# EAGLE board bms_v02 (EAGLE 6.5.0), part 1 of 2
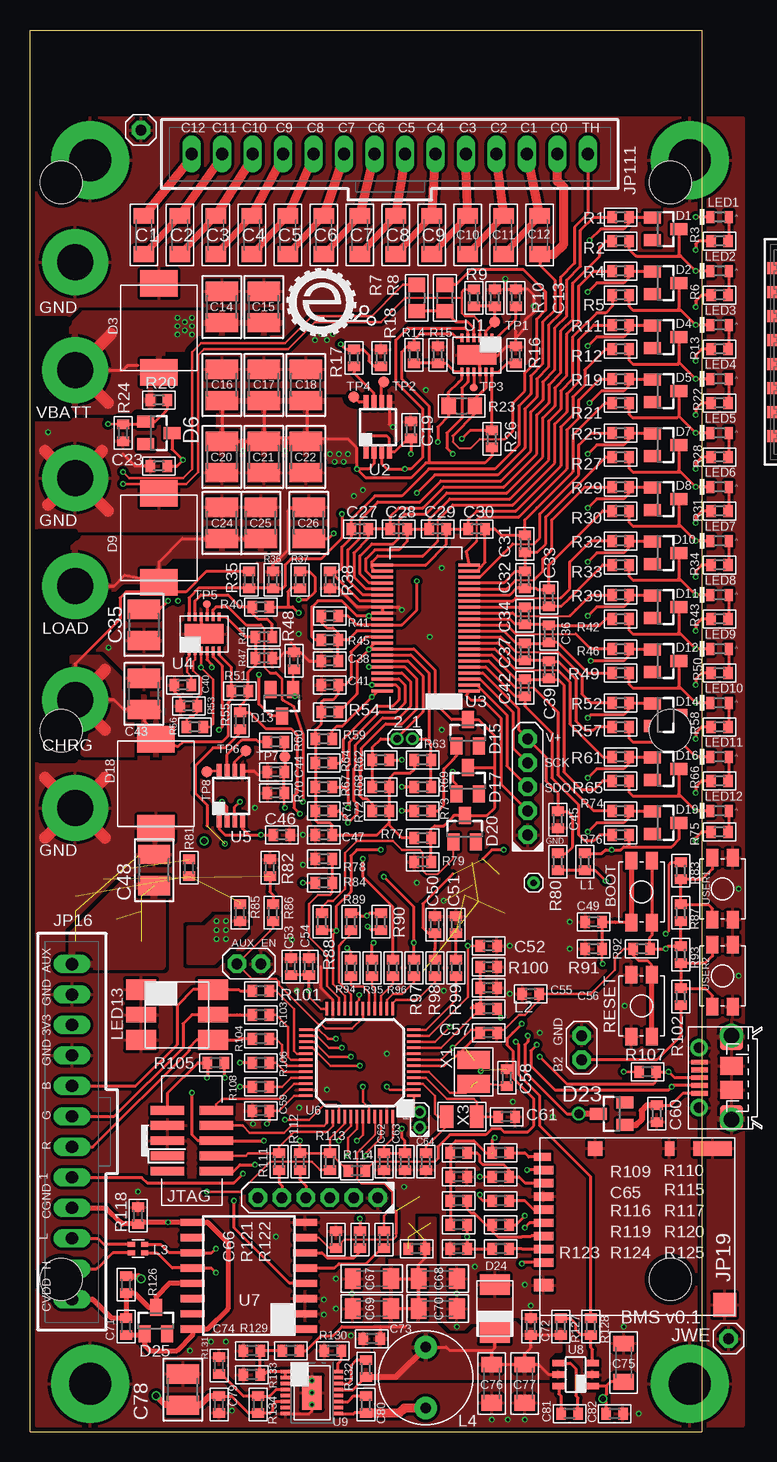
[diagram p3: board, top side]
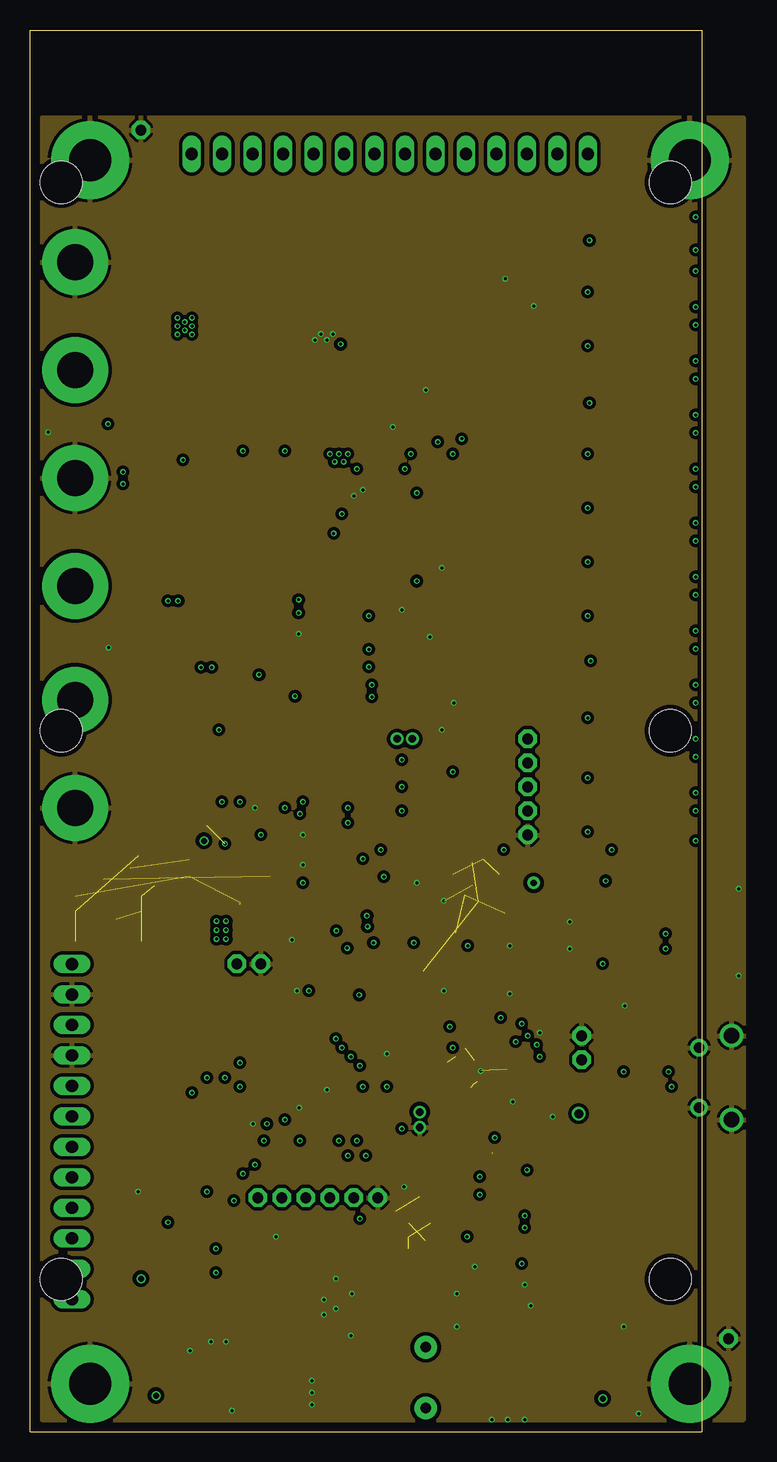
[diagram p4: board, inner layer Route2]
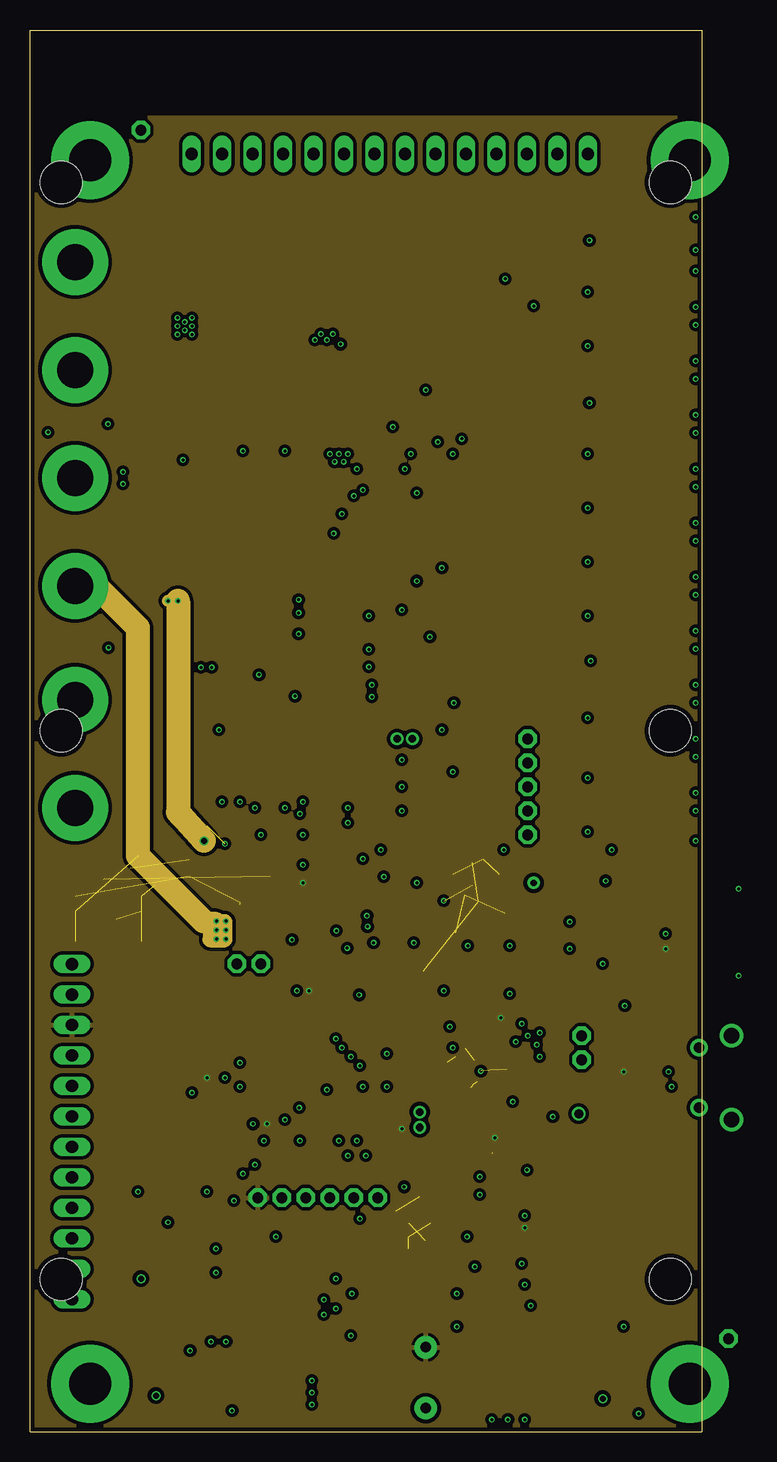
[diagram p5: board, inner layer Route15]
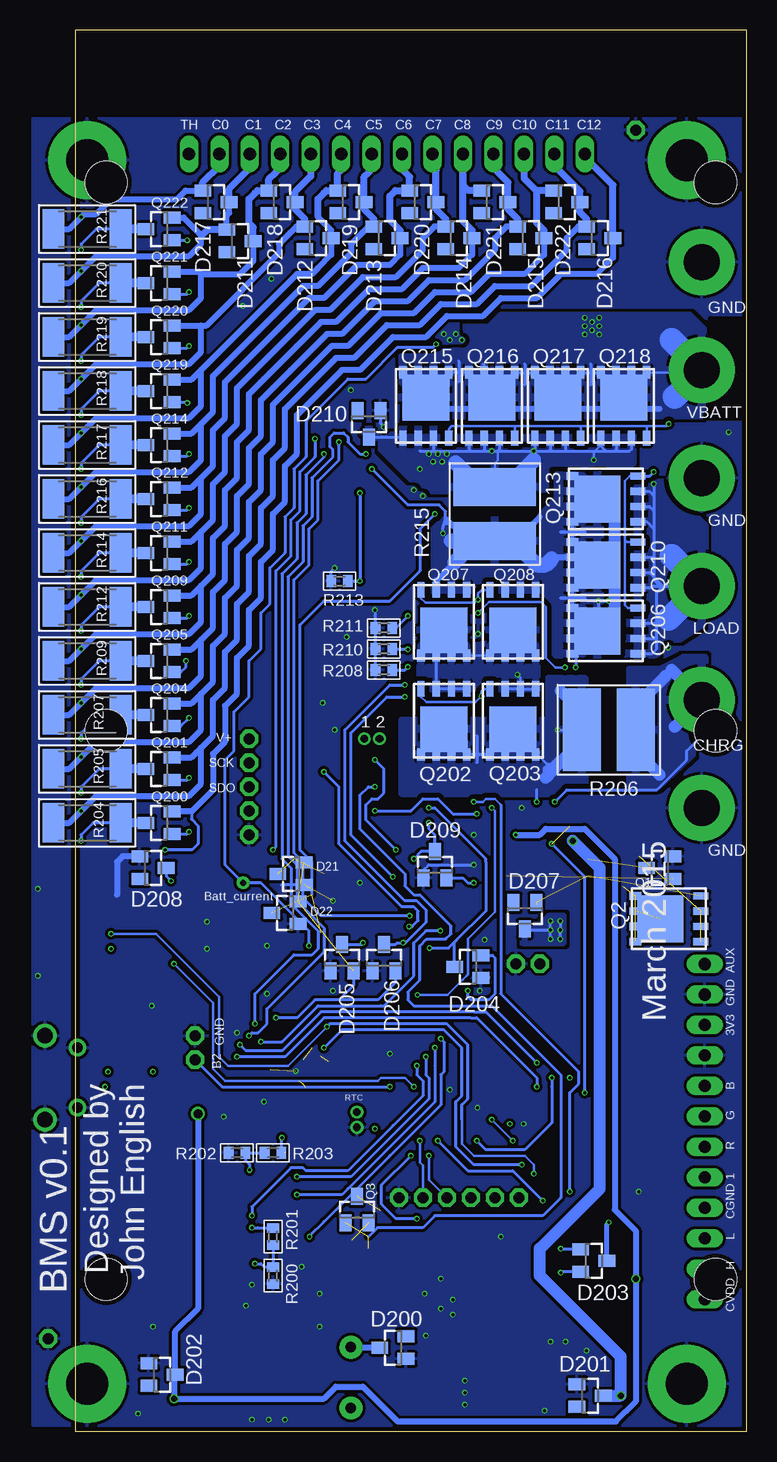
[diagram p6: board, bottom side, seen from below]

Size 56 x 116.84 mm. Coordinates in mm from the lower left corner, seen from the top.
Copper layers (1+2*15+16): Top 0.0356mm / dielectric 12mil / Route2 0.0356mm / dielectric 28mil / Route15 0.0356mm / dielectric 12mil / Bottom 0.0356mm
Design rules "OSH_park_4layer": minimum track width 5mil, minimum drill 10mil, track to track 5mil, track to pad 6mil, pad to pad 6mil, via to via 6mil, smd to smd 6mil, copper to edge 15mil, drill to drill 6mil, minimum pad ring 4mil, minimum via ring 4mil, stop-mask expansion 3mil, vias tented up to drill 20mil, thermal gap 10mil
tRestrict: area 0.8,56 to 3.8,56.2; area 0.8,74.8 to 3.8,75; area 0.2,84.5 to 3.2,84.8; area 0,92.5 to 3,92.8
bRestrict: area 0.2,84.5 to 3.2,84.8; area 0,92.5 to 3,92.8; area -0.5,54.5 to -0.2,57.5

## Footprints (pad centres in the part's own frame; a part is rotated, then mirrored left to right if it is on the bottom)
MOMENTARY_SW_EVQP2 = smd 1.45 x 1: P1 -2.575,-0.85; P2 -2.575,0.85; P3 2.575,-0.85; P4 2.575,0.85
1206_SILK = smd 1.3 x 1.7: P1 -1.6,0; P2 1.6,0
0603_SILK = smd 0.8 x 1: P1 -0.7,0; P2 0.7,0
1210_SILK = smd 1.6 x 2.7: 1 -1.3,0; 2 1.3,0
SOT23 = smd 1 x 1.4: 1 -0.95,-1.1; 2 0.95,-1.1; 3 0,1.1
SMC = smd 3.1 x 2.2: A 0,3.7; C 0,-3.7
SMA = smd 2.5 x 1.7: A 0,-2; C 0,2
HEADER-SMALL-1PIN-0.036IN = drill 0.914 pad 1.524 octagon: P1 0,0
HOLE_3.5MM = drill 3.5 pad 6.5: P$1 0,0
HOLE_3MM = drill 3 pad 5.5: P1 0,0
HEADER-SMALL-2PIN00.05IN = drill 0.635 pad 1.067: P1 -0.635,0; P2 0.635,0
HEADER_2MM_5PIN = drill 0.914 pad 1.524 octagon: P1 -4,0; P2 -2,0; P3 0,0; P4 2,0; P5 4,0
HEADER-SMALL-1PIN-0.02IN = drill 0.508 pad 1.067: P1 0,0
HEADER_2MM_2PIN = drill 0.914 pad 1.524 octagon: P1 -1,0; P2 1,0
USB-MICRO-B-MOLEX_105017 = smd 0.4 x 1.35: P1 -1.3,2.675; P2 -0.65,2.675; P3 0,2.675; P4 0.65,2.675; P5 1.3,2.675 | smd 1.5 x 1.9: PAD1 -1,0; PAD2 1,0 | smd 2 x 1.9: PAD3 -3.3,0; PAD4 3.3,0 | drill 1.3 pad 1.59: PAD3-HOLE -3.5,0; PAD4-HOLE 3.5,0 | drill 0.85 pad 1.45: THRUPAD1 -2.5,2.7; THRUPAD2 2.5,2.7
70543-12 = drill 1.016 long: 1 -13.97,0; 2 -11.43,0; 3 -8.89,0; 4 -6.35,0; 5 -3.81,0; 6 -1.27,0; 7 1.27,0; 8 3.81,0; 9 6.35,0; 10 8.89,0; 11 11.43,0; 12 13.97,0
HEADER_2MM_6PIN = drill 0.914 pad 1.524 octagon: P1 -5,0; P2 -3,0; P3 -1,0; P4 1,0; P5 3,0; P6 5,0
MICROSD_DM3BT = smd 0.7 x 1.6: P1 -4.4,8.175; P2 -3.3,8.175; P3 -2.2,8.175; P4 -1.1,8.175; P5 0,8.175; P6 1.1,8.175; P7 2.2,8.175; P8 3.3,8.175 | smd 0.7 x 1.4: P9 4.4,8.275 | smd 1.2 x 0.8: P10 5.1,-2.325 | smd 1.05 x 1.6: P11 -6.3,8.175 | smd 1.2 x 1.2: P12 5.1,3.875 | smd 1.2 x 3.2: P13 5.1,-5.925 | smd 2 x 1.9: P14 -7.95,-6.925
SCREWTERMINAL_7461057 = drill 1.475 pad 2.2: P1 -2.54,-2.54; P3 2.54,-2.54; P4 2.54,2.54; P5 0,2.54; P6 -2.54,2.54 | drill 1.47 pad 2.2: P2 0,-2.54
SCREWTERMINAL_0760010006 = drill 1.15 pad 2.5: P1 2.54,-3.18; P2 2.54,0; P3 2.54,3.18; P4 -2.54,3.18; P5 -2.54,0; P6 -2.54,-3.18
70543-14 = drill 1.016 long: 1 -16.51,0; 2 -13.97,0; 3 -11.43,0; 4 -8.89,0; 5 -6.35,0; 6 -3.81,0; 7 -1.27,0; 8 1.27,0; 9 3.81,0; 10 6.35,0; 11 8.89,0; 12 11.43,0; 13 13.97,0; 14 16.51,0
JTAG_9PIN_0.05IN_SMD = smd 0.737 x 2.794: P1 -2.54,-2.032; P2 -2.54,2.032; P3 -1.27,-2.032; P4 -1.27,2.032; P5 0,-2.032; P6 0,2.032; P7 1.27,-2.032; P8 1.27,2.032; P9 2.54,-2.032; P10 2.54,2.032
FILTER_EXC24CX = smd 0.4 x 0.6: P1 -0.35,-0.55; P2 0.35,-0.55; P3 0.35,0.55; P4 -0.35,0.55
INDUCTOR_RL895 = drill 0.889 pad 1.905: P1 -2.54,0; P2 2.54,0
LED_0603 = smd 0.65 x 1: 1 -0.775,0; 2 0.775,0
RGB_LED_CLV6A = smd 2.5 x 1.7: 1 -3,2.1; 3 -3,-2.1; 4 3,-2.1; 6 3,2.1 | smd 2.5 x 1.3: 2 -3,0; 5 3,0
POWERPAK_SO-8_SINGLE = smd 1.27 x 0.61: 1S -2.67,1.905; 2S -2.67,0.635; 3S -2.67,-0.635; 4G -2.67,-1.905 | smd 1.016 x 0.635: 5D 2.794,-1.905; 6D 2.794,-0.635; 7D 2.794,0.635; 8D 2.794,1.905 | smd 3.81 x 3.912: 9D 0.7,0
0805_SILK = smd 1.2 x 1.4: P1 -1.1,0; P2 1.1,0
2512_SILK = smd 1.8 x 3.3: 1 -2.8,0; 2 2.8,0
2725_SILK = smd 3.18 x 6.86: P1 -2.25,0; P2 2.25,0
TEST_POINT_0.036IN = smd 0.914 x 0.914: P1 0,0
TEST_POINT_0.025IN = smd 0.635 x 0.635: P1 0,0
DFN12 = smd 0.7 x 0.25: P1 -1.425,1.25; P2 -1.425,0.75; P3 -1.425,0.25; P4 -1.425,-0.25; P5 -1.425,-0.75; P6 -1.425,-1.25; P7 1.425,-1.25; P8 1.425,-0.75; P9 1.425,-0.25; P10 1.425,0.25; P11 1.425,0.75; P12 1.425,1.25 | smd 1.65 x 3.25: TAB 0,0
MSOP-8_LT = smd 1.2 x 0.4: 1 -2.05,0.975; 2 -2.05,0.325; 3 -2.05,-0.325; 4 -2.05,-0.975; 5 2.05,-0.975; 6 2.05,-0.325; 7 2.05,0.325; 8 2.05,0.975
SSOP44 = smd 1.8 x 0.25: 1 -3.625,5.25; 2 -3.625,4.75; 3 -3.625,4.25; 4 -3.625,3.75; 5 -3.625,3.25; 6 -3.625,2.75; 7 -3.625,2.25; 8 -3.625,1.75; 9 -3.625,1.25; 10 -3.625,0.75; 11 -3.625,0.25; 12 -3.625,-0.25; 13 -3.625,-0.75; 14 -3.625,-1.25; 15 -3.625,-1.75; 16 -3.625,-2.25; 17 -3.625,-2.75; 18 -3.625,-3.25; 19 -3.625,-3.75; 20 -3.625,-4.25; 21 -3.625,-4.75; 22 -3.625,-5.25; 23 3.625,-5.25; 24 3.625,-4.75; 25 3.625,-4.25; 26 3.625,-3.75; 27 3.625,-3.25; 28 3.625,-2.75; 29 3.625,-2.25; 30 3.625,-1.75; 31 3.625,-1.25; 32 3.625,-0.75; 33 3.625,-0.25; 34 3.625,0.25; 35 3.625,0.75; 36 3.625,1.25; 37 3.625,1.75; 38 3.625,2.25; 39 3.625,2.75; 40 3.625,3.25; 41 3.625,3.75; 42 3.625,4.25; 43 3.625,4.75; 44 3.625,5.25
TQFP48 = smd 0.2 x 1.1: 1 -2.75,-4.5; 2 -2.25,-4.5; 3 -1.75,-4.5; 4 -1.25,-4.5; 5 -0.75,-4.5; 6 -0.25,-4.5; 7 0.25,-4.5; 8 0.75,-4.5; 9 1.25,-4.5; 10 1.75,-4.5; 11 2.25,-4.5; 12 2.75,-4.5; 25 2.75,4.5; 26 2.25,4.5; 27 1.75,4.5; 28 1.25,4.5; 29 0.75,4.5; 30 0.25,4.5; 31 -0.25,4.5; 32 -0.75,4.5; 33 -1.25,4.5; 34 -1.75,4.5; 35 -2.25,4.5; 36 -2.75,4.5 | smd 1.1 x 0.2: 13 4.5,-2.75; 14 4.5,-2.25; 15 4.5,-1.75; 16 4.5,-1.25; 17 4.5,-0.75; 18 4.5,-0.25; 19 4.5,0.25; 20 4.5,0.75; 21 4.5,1.25; 22 4.5,1.75; 23 4.5,2.25; 24 4.5,2.75; 37 -4.5,2.75; 38 -4.5,2.25; 39 -4.5,1.75; 40 -4.5,1.25; 41 -4.5,0.75; 42 -4.5,0.25; 43 -4.5,-0.25; 44 -4.5,-0.75; 45 -4.5,-1.25; 46 -4.5,-1.75; 47 -4.5,-2.25; 48 -4.5,-2.75
SOIC-16_W_ANALOG = smd 0.6 x 2: P1 -4.445,-4.7; P2 -3.175,-4.7; P3 -1.905,-4.7; P4 -0.635,-4.7; P5 0.635,-4.7; P6 1.905,-4.7; P7 3.175,-4.7; P8 4.445,-4.7; P9 4.445,4.7; P10 3.175,4.7; P11 1.905,4.7; P12 0.635,4.7; P13 -0.635,4.7; P14 -1.905,4.7; P15 -3.175,4.7; P16 -4.445,4.7
SOT23-6 = smd 0.55 x 1.05: 1 -0.95,-1.4; 2 0,-1.4; 3 0.95,-1.4; 4 0.95,1.4; 5 0,1.4; 6 -0.95,1.4
17_MSOP = smd 0.889 x 0.275: 1 -2.17,1.75; 2 -2.17,1.25; 3 -2.17,0.75; 4 -2.17,0.25; 5 -2.17,-0.25; 6 -2.17,-0.75; 7 -2.17,-1.25; 8 -2.17,-1.75; 9 2.17,-1.75; 10 2.17,-1.25; 11 2.17,-0.75; 12 2.17,-0.25; 13 2.17,0.25; 14 2.17,0.75; 15 2.17,1.25; 16 2.17,1.75 | smd 1.651 x 2.845: 17 0,0
QFN-24-NP = smd 0.9 x 0.3: 1 -2.1,1.25; 2 -2.1,0.75; 3 -2.1,0.25; 4 -2.1,-0.25; 5 -2.1,-0.75; 6 -2.1,-1.25; 13 2.1,-1.25; 14 2.1,-0.75; 15 2.1,-0.25; 16 2.1,0.25; 17 2.1,0.75; 18 2.1,1.25 | smd 0.3 x 0.9: 7 -1.25,-2.1; 8 -0.75,-2.1; 9 -0.25,-2.1; 10 0.25,-2.1; 11 0.75,-2.1; 12 1.25,-2.1; 19 1.25,2.1; 20 0.75,2.1; 21 0.25,2.1; 22 -0.25,2.1; 23 -0.75,2.1; 24 -1.25,2.1
POWERBRICK_FULL_VICOR_MAXI = hole 3.5: 25.4,-45.72; 25.4,0; 25.4,45.72; -25.4,45.72; -25.4,0; -25.4,-45.72
NX3225GD = smd 1.5 x 2.7: P1 -1,0; P2 1,0
87832-16 = smd 1 x 2.75: 1 -7,-2.15; 2 -7,2.15; 3 -5,-2.15; 4 -5,2.15; 5 -3,-2.15; 6 -3,2.15; 7 -1,-2.15; 8 -1,2.15; 9 1,-2.15; 10 1,2.15; 11 3,-2.15; 12 3,2.15; 13 5,-2.15; 14 5,2.15; 15 7,-2.15; 16 7,2.15 | hole 1: -6,0; 6,0
ABS07 = smd 1.1 x 1.9: P1 -1.25,0; P2 1.25,0

## Placement (x,y rotation side)
BOOT  [MOMENTARY_SW_EVQP2]  51,45 270 top
C1  10uF  [1206_SILK]  9.5,99.75 270 top
C2  10uF  [1206_SILK]  12.5,99.75 270 top
C3  10uF  [1206_SILK]  15.5,99.75 270 top
C4  10uF  [1206_SILK]  18.5,99.75 270 top
C5  10uF  [1206_SILK]  21.5,99.75 270 top
C6  10uF  [1206_SILK]  24.5,99.75 270 top
C7  10uF  [1206_SILK]  27.5,99.75 270 top
C8  10uF  [1206_SILK]  30.5,99.75 270 top
C9  10uF  [1206_SILK]  33.5,99.75 270 top
C10  10uF  [1206_SILK]  36.5,99.75 270 top
C11  10uF  [1206_SILK]  39.5,99.75 270 top
C12  10uF  [1206_SILK]  42.5,99.75 270 top
C13  1uF  [0603_SILK]  40.5,94.5 90 top
C14  2.2uF  [1210_SILK]  16,93.75 90 top
C15  2.2uF  [1210_SILK]  19.5,93.75 90 top
C16  2.2uF  [1210_SILK]  16,87.25 90 top
C17  2.2uF  [1210_SILK]  19.5,87.25 90 top
C18  2.2uF  [1210_SILK]  23,87.25 90 top
C19  1uF  [0603_SILK]  31.75,83.5 90 top
C20  2.2uF  [1210_SILK]  16,81.25 270 top
C21  2.2uF  [1210_SILK]  19.5,81.25 270 top
C22  2.2uF  [1210_SILK]  23,81.25 270 top
C23  1uF  [0603_SILK]  10.75,80.5 180 top
C24  2.2uF  [1210_SILK]  16,75.75 90 top
C25  2.2uF  [1210_SILK]  19.25,75.75 90 top
C26  2.2uF  [1210_SILK]  23.25,75.75 90 top
C27  0.1uF  [0603_SILK]  27.5,75.25 180 top
C28  0.1uF  [0603_SILK]  30.75,75.25 180 top
C29  0.1uF  [0603_SILK]  34,75.25 180 top
C30  0.1uF  [0603_SILK]  37.25,75.25 180 top
C31  0.1uF  [0603_SILK]  41.25,74 90 top
C32  0.1uF  [0603_SILK]  41.25,71 90 top
C33  0.1uF  [0603_SILK]  43.25,69.5 90 top
C34  0.1uF  [0603_SILK]  41.25,68 90 top
C35  2.2uF  [1210_SILK]  9.5,67.25 270 top
C36  0.1uF  [0603_SILK]  43.25,66.5 90 top
C37  0.1uF  [0603_SILK]  41.25,65 90 top
C38  1uF  [0603_SILK]  25,64.25 180 top
C39  0.1uF  [0603_SILK]  43.25,63.5 90 top
C40  1uF  [0603_SILK]  12.75,62.25 180 top
C41  1uF  [0603_SILK]  25,62.25 180 top
C42  0.1uF  [0603_SILK]  41.25,62 90 top
C43  2.2uF  [1210_SILK]  9.5,61.5 90 top
C44  DNP  [0603_SILK]  20.5,55 180 top
C45  0.1uF  [0603_SILK]  44,51 270 top
C46  1uF  [0603_SILK]  21,49.75 0 top
C47  0.1uF  [0603_SILK]  24.5,49.75 180 top
C48  2.2uF  [1210_SILK]  10.35,46.8 90 top
C49  0.1uF  [0603_SILK]  47,42.5 180 top
C50  10nF  [0603_SILK]  33.75,42.25 90 top
C51  10nF  [0603_SILK]  35.5,42.25 90 top
C52  DNP  [0603_SILK]  38.25,40.5 0 top
C53  0.1uF  [0603_SILK]  21.75,38.75 90 top
C54  1uF  [0603_SILK]  23.25,38.75 90 top
C55  0.1uF  [0603_SILK]  38.25,37 0 top
C56  0.1uF  [0603_SILK]  41.75,36.5 180 top
C57  18pF  [0603_SILK]  38.25,33.25 0 top
C58  18pF  [0603_SILK]  39.75,29.5 90 top
C59  1uF  [0603_SILK]  19.25,26.75 180 top
C60  1uF  [0603_SILK]  52.25,26.5 270 top
C61  12.5pF  [0603_SILK]  39.75,26.25 0 top
C62  1uF  [0603_SILK]  29.5,22.5 270 top
C63  0.1uF  [0603_SILK]  31.25,22.5 270 top
C64  12.5pF  [0603_SILK]  33,22.5 270 top
C65  1uF  [0603_SILK]  35.75,21.25 0 top
C66  1uF  [0603_SILK]  25.5,16 90 top
C67  100uF  [1206_SILK]  28.5,12.75 180 top
C68  100uF  [1206_SILK]  34,12.75 0 top
C69  100uF  [1206_SILK]  28.5,10.25 180 top
C70  100uF  [1206_SILK]  34,10.25 0 top
C71  1uF  [0603_SILK]  8,8.75 270 top
C72  DNP  [0603_SILK]  41.75,8.75 90 top
C73  1uF  [0603_SILK]  28.5,7.75 180 top
C74  DNP  [0603_SILK]  18.5,6.75 180 top
C75  100uF  [1206_SILK]  49.5,5.75 90 top
C76  100uF  [1206_SILK]  38.5,4 270 top
C77  100uF  [1206_SILK]  41.25,4 270 top
C78  2.2uF  [1210_SILK]  12.75,3.5 90 top
C79  DNP  [0603_SILK]  15.75,2.25 270 top
C80  0.22uF  [0603_SILK]  28,2.25 270 top
C81  1uF  [0603_SILK]  45,1.5 0 top
C82  1uF  [0603_SILK]  48.75,1.5 0 top
D1  5V  [SOT23]  53,100.25 270 top
D2  5V  [SOT23]  53,95.75 270 top
D3  60V  [SMC]  10.75,92 0 top
D4  5V  [SOT23]  53,91.25 270 top
D5  5V  [SOT23]  53,86.75 270 top
D6  12V  [SOT23]  10.75,83.25 270 top
D7  5V  [SOT23]  53,82.25 270 top
D8  5V  [SOT23]  53,77.75 270 top
D9  60V  [SMC]  10.75,74.5 0 top
D10  5V  [SOT23]  53,73.25 270 top
D11  5V  [SOT23]  53,68.75 270 top
D12  5V  [SOT23]  53,64.25 270 top
D13  12V  [SOT23]  21,60.75 180 top
D14  5V  [SOT23]  53,59.75 270 top
D15  200mA  [SOT23]  36.5,58.25 0 top
D16  5V  [SOT23]  53,55.25 270 top
D17  200mA  [SOT23]  36.5,54.25 0 top
D18  60V  [SMC]  10.5,54 180 top
D19  5V  [SOT23]  53,50.75 270 top
D20  200mA  [SOT23]  36.25,50.25 0 top
D21  250mA  [SOT23]  38,46.5 90 bottom
D22  250mA  [SOT23]  38.5,43.25 90 bottom
D23  DNP  [SOT23]  48.5,26.5 90 top
D24  DNP  [SMA]  38.75,10.25 180 top
D25  5V  [SOT23]  10.5,9.25 0 top
D200  DNP  [SOT23]  29.5,7 90 bottom
D201  0.25A  [SOT23]  13.05,3 270 bottom
D202  DNP  [SOT23]  48.75,4.75 270 bottom
D203  26V  [SOT23]  12.75,14.25 270 bottom
D204  250mA  [SOT23]  23.25,38.75 90 bottom
D205  250mA  [SOT23]  33.75,39.5 0 bottom
D206  250mA  [SOT23]  30.25,39.5 0 bottom
D207  12V  [SOT23]  18.5,43 180 bottom
D208  56V  [SOT23]  49.5,47 270 bottom
D209  250mA  [SOT23]  26,47.25 0 bottom
D210  0.25A  [SOT23]  31.5,84 180 bottom
D211  5V  [SOT23]  42.25,99.25 270 bottom
D212  5V  [SOT23]  35.75,99.5 270 bottom
D213  5V  [SOT23]  30,99.5 270 bottom
D214  5V  [SOT23]  24,99.5 270 bottom
D215  5V  [SOT23]  18,99.5 270 bottom
D216  5V  [SOT23]  12.25,99.5 270 bottom
D217  5V  [SOT23]  44.25,102.5 270 bottom
D218  5V  [SOT23]  38.75,102.5 270 bottom
D219  5V  [SOT23]  33,102.5 270 bottom
D220  5V  [SOT23]  27,102.5 270 bottom
D221  5V  [SOT23]  21,102.5 270 bottom
D222  5V  [SOT23]  15,102.5 270 bottom
JP1  HEADER-1PIN0.036IN  [HEADER-SMALL-1PIN-0.036IN]  9.25,108.5 90 top
JP2  CONNECTOR-1PIN3.5MM  [HOLE_3.5MM]  5,106 0 top
JP3  CONNECTOR-1PIN3.5MM  [HOLE_3.5MM]  55,106 0 top
JP4  CONNECTOR-1PIN3MM  [HOLE_3MM]  3.75,97.5 270 top
JP5  CONNECTOR-1PIN3MM  [HOLE_3MM]  3.75,88.5 270 top
JP6  CONNECTOR-1PIN3MM  [HOLE_3MM]  3.75,79.5 0 top
JP7  CONNECTOR-1PIN3MM  [HOLE_3MM]  3.75,70.5 0 top
JP8  CONNECTOR-1PIN3MM  [HOLE_3MM]  3.75,61 0 top
JP9  HEADER-2PIN0.05IN  [HEADER-SMALL-2PIN00.05IN]  31.25,57.75 180 top
JP10  HEADER-5PIN2MM  [HEADER_2MM_5PIN]  41.5,53.75 90 top
JP11  CONNECTOR-1PIN3MM  [HOLE_3MM]  3.75,52 0 top
JP12  HEADER-1PIN0.02IN  [HEADER-SMALL-1PIN-0.02IN]  42,45.75 90 top
JP13  HEADER-2PIN2MM  [HEADER_2MM_2PIN]  18.25,39 180 top
JP14  HEADER-2PIN2MM  [HEADER_2MM_2PIN]  46,32 270 top
JP15  105017  [USB-MICRO-B-MOLEX_105017]  58.5,29.5 90 top
JP16  C-GRID-12-70543  [70543-12]  3.5,25 90 top
JP17  HEADER-2PIN0.05IN  [HEADER-SMALL-2PIN00.05IN]  32.5,26 90 top
JP18  HEADER-6PIN2MM  [HEADER_2MM_6PIN]  24,19.5 180 top
JP19  MICROSDDM3BT  [MICROSD_DM3BT]  51,18.5 90 top
JP20  HEADER-1PIN0.036IN  [HEADER-SMALL-1PIN-0.036IN]  58.25,7.75 90 top
JP21  CONNECTOR-1PIN3.5MM  [HOLE_3.5MM]  5,4 0 top
JP22  CONNECTOR-1PIN3.5MM  [HOLE_3.5MM]  55,4 0 top
JP26  CONNECTOR-1PIN7461057  [SCREWTERMINAL_7461057]  80,74 180 top  (outside the outline)
JP27  CONNECTOR-1PIN0760010006  [SCREWTERMINAL_0760010006]  83,13 270 top  (outside the outline)
JP28  CONNECTOR-1PIN0760010006  [SCREWTERMINAL_0760010006]  83,25 270 top  (outside the outline)
JP29  CONNECTOR-1PIN0760010006  [SCREWTERMINAL_0760010006]  83,37 270 top  (outside the outline)
JP30  CONNECTOR-1PIN0760010006  [SCREWTERMINAL_0760010006]  83,49 270 top  (outside the outline)
JP31  CONNECTOR-1PIN0760010006  [SCREWTERMINAL_0760010006]  81,61 270 top  (outside the outline)
JP111  C-GRID-14-70543  [70543-14]  30,106.5 0 top
JTAG  JTAG_9PIN0.05IN_SMD  [JTAG_9PIN_0.05IN_SMD]  13.5,24.25 270 top
L1  1uH  [0603_SILK]  46.25,47.5 270 top
L2  1uH  [0603_SILK]  38.25,35.25 180 top
L3  EMI_FILTER_2MODE  [FILTER_EXC24CX]  9,15.25 90 top
L4  10uH  [INDUCTOR_RL895]  33,4.5 90 top
LED1  2.2V  [LED_0603]  57.5,101.25 180 top
LED2  2.2V  [LED_0603]  57.5,96.75 180 top
LED3  2.2V  [LED_0603]  57.5,92.25 180 top
LED4  2.2V  [LED_0603]  57.5,87.75 180 top
LED5  2.2V  [LED_0603]  57.5,83.25 180 top
LED6  2.2V  [LED_0603]  57.5,78.75 180 top
LED7  2.2V  [LED_0603]  57.5,74.25 180 top
LED8  2.2V  [LED_0603]  57.5,69.75 180 top
LED9  2.2V  [LED_0603]  57.5,65.25 180 top
LED10  2.2V  [LED_0603]  57.5,60.75 180 top
LED11  2.2V  [LED_0603]  57.5,56.25 180 top
LED12  2.2V  [LED_0603]  57.5,51.75 180 top
LED13  LED_RGBCLV6A  [RGB_LED_CLV6A]  12.25,34.75 0 top
LOGO1  LOGOSILK_0.325IN  [LOGO_SILK_0.325IN]  21,91 0 top
Q1  1A  [SOT23]  7.25,47 90 bottom
Q2  25A  [POWERPAK_SO-8_SINGLE]  6.5,42.75 180 bottom
Q3  2.5A  [SOT23]  32.5,18.5 0 bottom
Q200  2.5A  [SOT23]  49,50.75 90 bottom
Q201  2.5A  [SOT23]  49,55.25 90 bottom
Q202  25A  [POWERPAK_SO-8_SINGLE]  25.25,59.25 270 bottom
Q203  25A  [POWERPAK_SO-8_SINGLE]  19.5,59.25 270 bottom
Q204  2.5A  [SOT23]  49,59.75 90 bottom
Q205  2.5A  [SOT23]  49,64.25 90 bottom
Q206  25A  [POWERPAK_SO-8_SINGLE]  11.75,66.75 180 bottom
Q207  25A  [POWERPAK_SO-8_SINGLE]  25.25,67.5 270 bottom
Q208  25A  [POWERPAK_SO-8_SINGLE]  19.5,67.5 270 bottom
Q209  2.5A  [SOT23]  49,68.75 90 bottom
Q210  25A  [POWERPAK_SO-8_SINGLE]  11.75,72.25 180 bottom
Q211  2.5A  [SOT23]  49,73.25 90 bottom
Q212  2.5A  [SOT23]  49,77.75 90 bottom
Q213  25A  [POWERPAK_SO-8_SINGLE]  11.75,77.75 180 bottom
Q214  2.5A  [SOT23]  49,82.25 90 bottom
Q215  25A  [POWERPAK_SO-8_SINGLE]  26.75,85.5 90 bottom
Q216  25A  [POWERPAK_SO-8_SINGLE]  21.25,85.5 90 bottom
Q217  25A  [POWERPAK_SO-8_SINGLE]  15.75,85.5 90 bottom
Q218  25A  [POWERPAK_SO-8_SINGLE]  10.25,85.5 90 bottom
Q219  2.5A  [SOT23]  49,86.75 90 bottom
Q220  2.5A  [SOT23]  49,91.25 90 bottom
Q221  2.5A  [SOT23]  49,95.75 90 bottom
Q222  2.5A  [SOT23]  49,100.25 90 bottom
R1  3.3K  [0603_SILK]  49.25,101.25 0 top
R2  100  [0603_SILK]  49.25,99.25 0 top
R3  100  [0603_SILK]  57.5,99.25 180 top
R4  3.3K  [0603_SILK]  49.25,96.75 0 top
R5  100  [0603_SILK]  49.25,94.75 0 top
R6  100  [0603_SILK]  57.5,94.75 180 top
R7  22  [0805_SILK]  32.25,94.5 270 top
R8  0  [0805_SILK]  34.6,94.5 90 top
R9  DNP  [0603_SILK]  37,94.5 90 top
R10  DNP  [0603_SILK]  38.75,94.5 270 top
R11  3.3K  [0603_SILK]  49.25,92.25 0 top
R12  100  [0603_SILK]  49.25,90.25 0 top
R13  100  [0603_SILK]  57.5,90.25 180 top
R14  DNP  [0603_SILK]  32,89.75 90 top
R15  100K  [0603_SILK]  34,89.75 270 top
R16  100K  [0603_SILK]  40.5,89.75 270 top
R17  100K  [0603_SILK]  27,89.5 90 top
R18  220K  [0603_SILK]  29.25,89.5 270 top
R19  3.3K  [0603_SILK]  49.25,87.75 0 top
R20  DNP  [0603_SILK]  10.75,86 180 top
R21  100  [0603_SILK]  49.25,85.75 0 top
R22  100  [0603_SILK]  57.5,85.75 180 top
R23  DNP  [0805_SILK]  36,85.5 0 top
R24  2M  [0603_SILK]  7.75,83.25 90 top
R25  3.3K  [0603_SILK]  49.25,83.25 0 top
R26  2.4M  [0603_SILK]  38.5,82.75 270 top
R27  100  [0603_SILK]  49.25,81.25 0 top
R28  100  [0603_SILK]  57.5,81.25 180 top
R29  3.3K  [0603_SILK]  49.25,78.75 0 top
R30  100  [0603_SILK]  49.25,76.75 0 top
R31  100  [0603_SILK]  57.5,76.75 180 top
R32  3.3K  [0603_SILK]  49.25,74.25 0 top
R33  100  [0603_SILK]  49.25,72.25 0 top
R34  100  [0603_SILK]  57.5,72.25 180 top
R35  2.4M  [0603_SILK]  18.25,71 90 top
R36  100K  [0603_SILK]  20.25,71 270 top
R37  22  [0603_SILK]  22.5,71 90 top
R38  0  [0603_SILK]  25,71 90 top
R39  3.3K  [0603_SILK]  49.25,69.75 0 top
R40  0  [0603_SILK]  19.25,68.75 180 top
R41  100K  [0603_SILK]  25,68 180 top
R42  100  [0603_SILK]  49.25,67.75 0 top
R43  100  [0603_SILK]  57.5,67.75 180 top
R44  DNP  [0603_SILK]  19.5,66.25 0 top
R45  100K  [0603_SILK]  25,66 0 top
R46  3.3K  [0603_SILK]  49.25,65.25 0 top
R47  100K  [0603_SILK]  19.5,64.5 180 top
R48  1M  [0603_SILK]  22,64.25 270 top
R49  100  [0603_SILK]  49.25,63.25 0 top
R50  100  [0603_SILK]  57.5,63.25 180 top
R51  DNP  [0603_SILK]  17.5,61.75 180 top
R52  3.3K  [0603_SILK]  49.25,60.75 0 top
R53  DNP  [0603_SILK]  13.25,60.5 0 top
R54  22  [0603_SILK]  25,60 180 top
R55  100  [0603_SILK]  17.5,59.25 90 top
R56  DNP  [0603_SILK]  13.75,58.75 0 top
R57  100  [0603_SILK]  49.25,58.75 0 top
R58  100  [0603_SILK]  57.5,58.75 180 top
R59  1M  [0603_SILK]  24.5,57.75 180 top
R60  100K  [0603_SILK]  20.5,57.5 0 top
R61  3.3K  [0603_SILK]  49.25,56.25 0 top
R62  DNP  [0603_SILK]  29.25,56 180 top
R63  DNP  [0603_SILK]  32.75,56 180 top
R64  1M  [0603_SILK]  24.5,55.75 180 top
R65  100  [0603_SILK]  49.25,54.25 0 top
R66  100  [0603_SILK]  57.5,54.25 180 top
R67  1M  [0603_SILK]  24.5,53.75 180 top
R68  DNP  [0603_SILK]  29.25,53.75 0 top
R69  22  [0603_SILK]  32.75,53.75 0 top
R70  220K  [0603_SILK]  20.5,53.25 0 top
R71  1M  [0603_SILK]  24.5,51.75 180 top
R72  22  [0603_SILK]  29.25,51.75 0 top
R73  22  [0603_SILK]  32.75,51.75 0 top
R74  3.3K  [0603_SILK]  49.25,51.75 0 top
R75  100  [0603_SILK]  57.5,50 180 top
R76  100  [0603_SILK]  49.25,49.75 0 top
R77  DNP  [0603_SILK]  32.75,49.5 180 top
R78  RT100K  [0603_SILK]  24.5,47.75 0 top
R79  DNP  [0603_SILK]  32.75,47.5 0 top
R80  100  [0603_SILK]  44,47.5 90 top
R81  1M  [0603_SILK]  13.25,47 270 top
R82  100K  [0603_SILK]  20,47 90 top
R83  100  [0603_SILK]  54.25,46.75 90 top
R84  1M  [0603_SILK]  24.5,45.75 180 top
R85  220K  [0603_SILK]  17.5,43.25 270 top
R86  100  [0603_SILK]  20.25,43.25 90 top
R87  100K  [0603_SILK]  54.25,43.25 270 top
R88  22  [0603_SILK]  24.35,42.5 90 top
R89  100  [0603_SILK]  26.75,42.5 90 top
R90  22  [0603_SILK]  29.25,42.5 270 top
R91  100K  [0603_SILK]  47,40.25 0 top
R92  100K  [0603_SILK]  51,40.25 0 top
R93  100K  [0603_SILK]  54.25,39.75 90 top
R94  22  [0603_SILK]  26.75,38.65 270 top
R95  22  [0603_SILK]  28.5,38.65 270 top
R96  22  [0603_SILK]  30.25,38.65 270 top
R97  22  [0603_SILK]  32,38.65 270 top
R98  100  [0603_SILK]  33.75,38.65 270 top
R99  100  [0603_SILK]  35.5,38.65 270 top
R100  DNP  [0603_SILK]  38.25,38.75 180 top
R101  560  [0603_SILK]  19.25,36.75 0 top
R102  100  [0603_SILK]  54.25,36.25 270 top
R103  560  [0603_SILK]  19.25,34.75 0 top
R104  560  [0603_SILK]  19.25,32.75 0 top
R105  100K  [0603_SILK]  15.5,30.75 180 top
R106  22  [0603_SILK]  19.25,30.75 0 top
R107  3.3K  [0603_SILK]  51.5,30 180 top
R108  22  [0603_SILK]  19.25,28.75 0 top
R109  33K  [0603_SILK]  35.75,23.25 180 top
R110  100K  [0603_SILK]  39.25,23.25 180 top
R111  22  [0603_SILK]  20.75,22.5 270 top
R112  100  [0603_SILK]  22.5,22.5 270 top
R113  100  [0603_SILK]  25,22.5 270 top
R114  100  [0603_SILK]  27.25,21.75 0 top
R115  22  [0603_SILK]  39.25,21.25 0 top
R116  33K  [0603_SILK]  35.75,19.25 180 top
R117  22  [0603_SILK]  39.25,19.25 0 top
R118  DNP  [0603_SILK]  9,18 270 top
R119  DNP  [0603_SILK]  35.75,17.25 0 top
R120  22  [0603_SILK]  39.25,17.25 180 top
R121  22  [0603_SILK]  27.5,16 270 top
R122  22  [0603_SILK]  29.5,16 270 top
R123  220K  [0603_SILK]  32.25,15.25 180 top
R124  1M  [0603_SILK]  35.75,15.25 0 top
R125  22  [0603_SILK]  39.25,15.25 0 top
R126  DNP  [0603_SILK]  8,12.25 90 top
R127  DNP  [0603_SILK]  44.25,8.75 90 top
R128  22  [0603_SILK]  46.75,8.75 270 top
R129  0  [0603_SILK]  21.75,6.75 0 top
R130  374K  [0603_SILK]  25.25,6.75 0 top
R131  100K  [0603_SILK]  15.75,5.5 270 top
R132  1M  [0603_SILK]  28,5.25 90 top
R133  DNP  [0603_SILK]  18.5,4.75 0 top
R134  2.6M  [0603_SILK]  19,2.25 270 top
R200  DNP  [0603_SILK]  39.5,13 90 bottom
R201  DNP  [0603_SILK]  39.5,16.25 90 bottom
R202  DNP  [0603_SILK]  42.5,23.25 0 bottom
R203  DNP  [0603_SILK]  39.5,23.25 0 bottom
R204  10  [2512_SILK]  55,50.75 0 bottom
R205  10  [2512_SILK]  55,55.25 0 bottom
R206  0.005  [2725_SILK]  11.5,58.5 180 bottom
R207  10  [2512_SILK]  55,59.75 0 bottom
R208  DNP  [0603_SILK]  30.25,63.5 0 bottom
R209  10  [2512_SILK]  55,64.25 0 bottom
R210  DNP  [0603_SILK]  30.25,65.25 0 bottom
R211  RT100K  [0603_SILK]  30.25,67 0 bottom
R212  10  [2512_SILK]  55,68.75 0 bottom
R213  RT100K  [0603_SILK]  33.95,70.9 0 bottom
R214  10  [2512_SILK]  55,73.25 0 bottom
R215  0.005  [2725_SILK]  21,76.5 270 bottom
R216  10  [2512_SILK]  55,77.75 0 bottom
R217  10  [2512_SILK]  55,82.25 0 bottom
R218  10  [2512_SILK]  55,86.75 0 bottom
R219  10  [2512_SILK]  55,91.25 0 bottom
R220  10  [2512_SILK]  55,95.75 0 bottom
R221  10  [2512_SILK]  55,100.25 0 bottom
RESET  [MOMENTARY_SW_EVQP2]  51,35.5 270 top
TP1  TEST_POINT0.036IN  [TEST_POINT_0.036IN]  38.75,92.5 90 top
TP2  TEST_POINT0.036IN  [TEST_POINT_0.036IN]  29.5,87.5 90 top
TP3  TEST_POINT0.025IN  [TEST_POINT_0.025IN]  37,87.01 0 top
TP4  TEST_POINT0.036IN  [TEST_POINT_0.036IN]  27,86.25 90 top
TP5  TEST_POINT0.025IN  [TEST_POINT_0.025IN]  14.75,69 0 top
TP6  TEST_POINT0.036IN  [TEST_POINT_0.036IN]  18,56.75 0 top
TP7  TEST_POINT0.036IN  [TEST_POINT_0.036IN]  21.25,56.25 0 top
TP8  TEST_POINT0.036IN  [TEST_POINT_0.036IN]  14.75,55 0 top
U1  LT4356  [DFN12]  37.25,89.75 270 top
U2  LT1999MS  [MSOP-8_LT]  29,83.75 90 top
U3  LTC6803-3  [SSOP44]  33,67 180 top
U4  LT4356  [DFN12]  14.5,66.5 90 top
U5  LT1999MS  [MSOP-8_LT]  16.75,53 90 top
U6  STM32F303  [TQFP48]  27.5,30.75 90 top
U7  ADM3054  [SOIC-16_W_ANALOG]  18.25,13 90 top
U8  LTC1754-X  [SOT23-6]  45.5,4.75 90 top
U9  LT3990MSE  [17_MSOP]  23.5,3.25 0 top
U11  MPU-9150  [QFN-24-NP]  -41,0 0 top  (outside the outline)
U13  POWERBRICK_FULL  [POWERBRICK_FULL_VICOR_MAXI]  28,58.42 0 top
USER1  [MOMENTARY_SW_EVQP2]  57.75,45.25 90 top
USER2  [MOMENTARY_SW_EVQP2]  57.75,38 90 top
X1  8Mhz  [NX3225GD]  37,30 270 top
X2  87832-16  [87832-16]  65,90 90 top  (outside the outline)
X3  32.768Khz  [ABS07]  36,26.25 180 top
X4  87832-16  [87832-16]  -21,18 90 top  (outside the outline)

## Tracks (layer width: path | path; a pad name or v marks a point on that pad's centre or on a via)
5V_SHDN  (via drill 0.25)
  Top 0.2: U6.21 26.25,35.75 26.25,36.3 25.25,37.3 25.25,40 25.25,40.75 25.25,41.25 25.25,41.45 v25.55,41.75
  Top 0.25: R128.P1 46.75,21.25 42.5,25.5 42.5,28 40.75,29.75 40.75,31.75 40.75,32.25 v40.5,32.5 | v29.25,48.5 28.5,48.5 27.25,48.5 26.75,48 26.75,45 25.55,43.8 v25.55,41.75 25.5,41.8 R88.P1 | R62.P1 v31,56
  Bottom 0.25: v40.5,32.5 38.75,32.5 35.75,35.5 30.5,35.5 30.25,35.5 27.75,38 27.75,40.75 26.75,41.75 v25.55,41.75 | v29.25,48.5 31.75,51 31.75,52.25 31.25,52.75 30.75,52.75 30.25,53.25 30.25,55.25 v31,56
+3V3  (via drill 0.25)  (4 unrouted)
  Top 0.2: U6.48 30.25,24.5 29.5,23.75 C62.P1 C63.P1 | U6.36 22,28 20.75,26.75 C59.P1 | R107.P2 v49.5,30 | R84.P2 v22.75,45.75 | U6.24 24.25,35.25 23.25,36.25 v23.25,36.75
  Top 0.25: R119.P1 R116.P2 C65.P1 R109.P2 35.05,23.8 35.5,24.25 37,24.25 38,23.25 38.5,23.25 | JP19.P4 41.65,17.4 v41.25,17 | U8.5 43.25,4.75 42.4,5.6 C77.P1 | C77.P1 C76.P1 38.5,6.75 | C77.P1 41.25,6.5 41.75,7 C72.P1 R127.P1 | 38.5,6.75 38.75,7 D24.C | R129.P2 23,6.75 24.25,8 25.25,8 26,8.75 29.25,8.75 | 29.25,8.75 31.29,8.75 | 30.1,9.94 C69.P1 C70.P1 C68.P1 | C67.P1 C68.P1 | 38.5,6.75 35,6.75 34.71,7.04 L4.P2 | 32.95,15.95 R123.P1 32.95,14.45 32.4,13.9 C68.P1 | R110.P2 38.55,24.3 v38.75,24.5 | R87.P2 R93.P2 53.2,40.45 v53,40.25 R92.P2 51.7,41.2 51.85,41.35 BOOT.P4 BOOT.P2 | v23.25,36.75 C54.P1 C53.P1 | C59.P1 19.95,25.85 v19.75,25.65 | C63.P1 31.25,24.25 31,24.5 v31,25.25 | JTAG.P1 11.47,28.22 14,30.75 R105.P2 14.8,29.55 v14.75,29.5 | L2.P1 v39.25,34.5 | C73.P1 29.25,7.8 29.25,8.75
  Top 0.27: U9.13 26.95,3.5 R132.P1
  Top 0.5: R132.P1 30.51,4.55 L4.P2
  Bottom 0.25: R203.P2 38.8,24.45 v38.75,24.5 | D209.2 23.65,46.15 23.25,45.75 v22.75,45.75 | D204.2 21.2,39.7 21,39.5 21,36.5 21.5,36 23,36 23.25,36.25 v23.25,36.75 | 38.7,34.5 v39.25,34.5 37.5,34.5 36,36 34,36 | D206.2 29.3,37.45 30.75,36 34,36 | D205.2 32.8,37.2 34,36 | v41.25,17 40.75,17 40.7,16.95 R201.P2
  Bottom 0.5: D200.3 32.9,7 arc45 L4.P2
  pour Route15 (isolate 0.3, rank 6): 0.5,0.5 59.5,0.5 59.5,109.5 0.5,109.5
  pour Top (isolate 0.25, rank 3): 27.75,4.5 44,4.5 44,5 43.75,5 43.25,5.5 43.25,6.25 43.75,6.75 44.25,6.75 44.25,8.5 41,8.5 40,9.5 38,9.5 36.5,8 34.75,8 33.75,9 33.75,17.75 32.5,17.75 32.5,14.25 30,14.25 30,8.75 28.75,8.75 28.75,5.75 28.25,5.25 27.75,5.25
+5V  (via drill 0.25, 0.5, 0.75)
  Top 0.25: U8.1 48.05,3.8 | 48.05,3.8 48.4,4.15 C75.P1 | C82.P1 48.05,2.45 v47.75,2.75 48.05,3.05 48.05,3.8 | U5.4 17.73,50.27 18.25,49.75 | 18.25,49.75 v19.25,49.75 C46.P1 | U5.1 15.78,50.23 16.25,49.75 18.25,49.75 | v41.5,33 41.5,32.5 41.25,32.25 41.25,30 44.75,26.5 v45.75,26.5 | U2.1 28.02,82.78 28.25,83 29.75,83 29.98,82.78 U2.4 30.45,81.7 31.55,82.8 C19.P1 v31.75,81.5
  Top 0.5: D23.3 v45.75,26.5 | R126.P2 9.05,12.95 v9.25,12.75
  Bottom 0.25: v41.5,33 41.25,33.25 40.75,33.25 40,34 40,35.25 35.25,40 35.25,42 37.5,44.25 37.5,47.25 38.25,48 38.25,71.25 37,72.5 37,75.5 36.25,76.25 36.25,79.5 34.5,81.25 34.5,81.85 34.75,82.1 34.75,82.9 34.4,83.25 33.6,83.25 33.25,82.9 33.25,82.5 32.25,81.5 v31.75,81.5
  Bottom 0.5: v45.75,26.5 45.75,10.25 47.65,8.35 D202.3 47.75,4.65 v47.75,2.75 35.25,2.75 34.25,3.75 32,3.75 29.1,0.85 10.9,0.85 9.25,2.5 v9.25,12.75 9.25,16.75 11,18.5 11,47.75 13.5,50.25 16.75,50.25 17.25,49.75 v19.25,49.75
AUX_EN
  Top 0.2: U6.18 27.75,34.5 26.85,33.6 24.65,33.6 24.3,33.95 24.05,33.95 21,37 20.75,37.25 20.75,37.5 20.5,37.75 19.25,37.75 18.5,37.75 JP13.P2 20,41.75 20.25,42 R86.P1
AUX_OUT  (5 unrouted)
  pour Top (isolate 0.5, rank 3): 3.5,41.5 7.75,45.75 11,45.75 11,38.75 3.5,38.75
BATT_CURRENT  (via drill 0.25)
  Top 0.2: U6.11 33.25,33 36.5,36.25 36.5,39.75 v36.5,40.5 C52.P1
  Top 0.25: 29.2,88.8 R18.P2 29.2,88.8 | 29.2,88.8 28.7,88.8 28.5,89 28.25,89.25 28.25,89.75 27.8,90.2 R17.P2 26.35,90.2 v25.9,90.65
  Bottom 0.25: v36.5,40.5 36.5,41.75 38.5,43.75 40.5,45.75 JP12.P1 43.5,47.25 43.5,56 42.75,56.75 42.75,58.25 42.75,60 41.5,61.25 41.5,64.25 40.5,65.25 40.5,68.25 39.75,69 39.75,72 38.5,73.25 38.5,76.25 37.75,77 37.75,80.25 36.75,81.25 36.75,84.25 33.25,87.75 31.75,87.75 29.1,90.4 26.15,90.4 v25.9,90.65
BOOT0  (via drill 0.25)
  Top 0.2: U6.44 28.25,27 27.75,27.5 v27.75,28.75 | R91.P2 47.7,39.05 v47.75,39
  Top 0.25: BOOT.P3 48.83,42.42 48.75,42.5 C49.P1 R91.P2
  Top 0.4: BOOT.P1 BOOT.P3
  Bottom 0.2: v27.75,28.75 28.5,29.5 30.5,29.5 30.75,29.25 43.5,29.25 44.5,30.25 44.5,35.75 v47.75,39
BUTTON1  (via drill 0.25)
  Top 0.2: U6.10 33.75,32.5 v35,33.75 | R83.P2 53.45,47.45 53.25,47.25 53.25,41.75 v53,41.5
  Top 0.25: v17.75,21.5 17,20.75 9.75,20.75 9.33,21.17 3.52,21.17 JP16.5
  Bottom 0.2: v53,41.5 49.25,41.5 44,36.25 44,31.25 43.25,30.5 38.25,30.5 v35,33.75 | 23.75,26 23.75,24 22.75,23 18.5,23 17.75,22.25 v17.75,21.5
  Bottom 0.25: 23.75,26 23.75,27.25 23.25,27.75 23.25,32.25 25,34 34.75,34 v35,33.75
BUTTON2  (via drill 0.25)
  Top 0.2: U6.2 30,28.5 v29.75,28.75
  Top 0.25: R102.P2 54.25,33 52.25,31 JP14.P2
  Bottom 0.25: JP14.P2 43.75,28.75 v29.75,28.75
C0  (via drill 0.25)
  Top 0.25: U3.29 27.5,69.25 25.05,71.7 R38.P2 25.7,71.7 26,72 26,73.75 26.75,74.5 26.75,75.25 C27.P2 26.8,76.05 28.75,78 31,78 33.25,80.25 38.75,80.25 40.75,82.25 40.75,85.5 41.75,86.5 41.75,88 42.74,88.99 42.74,92.49 43.75,93.5 43.75,96 42.5,97.25 C12.P2 | LED1.2 v55.5,101.25
  Top 0.75: C12.P2 43.65,98.15 44.5,99 44.5,103.75 44.25,104 43.97,104.22 JP111.13
  Bottom 0.5: R221.1 56.5,100.25 v55.5,101.25 55.25,101.5 54.25,101.5 53,102.75 47.5,102.75 46.8,103.45 D217.1
  Bottom 0.6: D217.1 45.35,104.15 43.97,105.53 JP111.13
C1
  Top 0.25: U3.27 28,70.25 27,71.25 27,73.25 28.2,74.45 C27.P1 C28.P2 30.05,76.3 30.75,77 32.75,77 34.5,78.75 39.5,78.75 42.25,81.5 42.25,84.75 43.25,85.75 43.25,87.25 44.24,88.24 44.24,91.74 45.25,92.75 45.25,95.75 47.5,98 47.5,98.75 48,99.25 R2.P1
C2
  Top 0.25: U3.25 28.5,71.25 28,71.75 28,72.75 28.75,73.5 30.75,73.5 31.45,74.2 C28.P1 C29.P2 33.3,76.05 35,77.75 40,77.75 43.25,81 43.25,84.25 44.25,85.25 44.25,86.75 45.24,87.74 45.24,91.24 47.25,93.25 48,93.25 48.55,93.8 R5.P1
C3
  Top 0.25: R12.P1 48,90.25 46.38,88.62 46.25,88.5 46.25,87.25 45.25,86.25 45.25,84.75 44.25,83.75 44.25,80.5 40.5,76.75 37.25,76.75 36.55,76.05 C30.P2 C29.P1 34.7,73.95 33,72.25 U3.23
C4
  Top 0.25: R21.P1 48,85.75 47.95,85.75 45.25,83.05 45.25,80 42.25,77 41.25,76 C31.P2 39.3,74.7 39,75 38.75,75.25 C30.P1 37.95,72.45 37.5,72 37.25,71.75 U3.21
C5
  Top 0.25: R27.P1 48,81.25 43,76.25 43,74 42.3,73.3 C31.P1 C32.P2 40.45,71.7 39.5,70.75 U3.19
C6
  Top 0.25: R30.P1 47.75,76.75 47.5,76.5 43.25,72.25 43.25,71.5 C33.P2 42.3,70.2 42.25,70.25 42.2,70.3 C32.P1 40.55,70.3 40,69.75 U3.17
C7
  Top 0.25: R33.P1 47.75,72.25 45,69.5 44.3,68.8 C33.P1 43.15,68.7 C34.P2 40.55,68.7 40.5,68.75 U3.15
C8
  Top 0.25: R42.P1 48,67.75 47.5,67.25 47.45,67.2 C36.P2 43.15,67.3 C34.P1 40.45,67.3 40.25,67.5 40,67.75 U3.13
C9
  Top 0.25: U3.11 39.5,66.75 40.5,65.75 40.55,65.7 C37.P2 43.15,65.7 C36.P1 43.95,65.8 46.5,63.25 47.25,63.25 R49.P1
C10
  Top 0.25: R57.P1 47.25,58.75 47,58.5 46.25,58.5 45.5,59.25 45.5,62.75 44.05,64.2 C39.P2 43.15,64.3 C37.P1 40.45,64.3 40.25,64.5 39,65.75 U3.9
C11
  Top 0.25: R65.P1 47.75,54.25 47,53.5 46,53.5 44.5,55 44.5,62.25 44.05,62.7 43.15,62.7 | U3.7 38.5,64.75 40.5,62.75 40.55,62.7 C42.P2 43.15,62.7 | 43.15,62.7 C39.P1
C12
  Top 0.25: U3.5 38,63.75 40.25,61.5 40.45,61.3 C42.P1 41.25,60.75 41.25,60.5 43.5,58.25 43.5,54.5 45.75,52.25 45.75,49.75 46.25,49.25 47,49.25 47.5,49.75 R76.P1
CAN_H
  Top 0.25: L3.P4 6.9,14.9 5.75,13.75 5.55,13.55 5.53,13.57 JP16.2
CAN_L
  Top 0.25: L3.P3 6.15,15.6 5.75,16 5.66,16.09 5.64,16.11 JP16.3
CAN_PWR  (via drill 0.25)
  Top 0.2: U6.41 26.75,25.5 25.75,24.5 v25.75,24.25
  Top 0.25: U7.P4 21.64,12.37 17,17 v17,19.25
  Bottom 0.25: v25.75,24.25 23.25,21.75 19.5,21.75 v17,19.25
CAN_RX
  Top 0.18: U6.45 28.75,24.75 27.5,23.5 27.25,23.25 27.25,21.1 27.25,21.05 27.6,20.7 29.5,20.7 30.2,20 30.2,18.7 29.5,18
  Top 0.2: R122.P1 29.5,18
CAN_SHDN  (via drill 0.25)  (2 unrouted)
  Top 0.25: R69.P1 31.5,53.75 | 31.5,53.75 v31,53.75 31.5,53.75
  Bottom 0.25: 31.55,16.25 30.8,17 27,17 26,18 17,18 15.5,19.5 15.5,29.75 21.25,35.5 27.75,35.5 28.25,36 28.25,36.65 27.25,37.65 27.25,40.5 26.7,41.05 25.1,41.05 24.65,41.5 24.65,42.15 27.25,44.75 27.75,44.75 28.5,45.5 28.5,46.5 32.25,50.25 32.25,53.05 31.55,53.75 v31,53.75
CAN_TX  (via drill 0.25)
  Top 0.2: U6.46 29.25,24.5 28.25,23.5 28,23.25 v28,23
  Top 0.25: v27.5,17.75 R121.P1
  Bottom 0.25: v27.5,17.75 29.25,17.75 30.45,18.95 30.45,20.55 v28,23
CAN_VDD
  Top 0.25: 6.8,9.45 6.75,9.5 | 8.7,11.55 8.75,11.5
  Top 0.4: 6.75,9.5 5.24,11.01 5.22,11.03 JP16.1 | 6.8,9.45 C71.P1 R126.P1 8.7,11.55 | 8.75,11.5 9.9,10.35 D25.3 10.5,11.25 11.62,12.37 U7.P13
CD
  Top 0.25: JP19.P9 41.6,22.9 41.5,23 41.25,23.25 R110.P1
CELL1  (via drill 0.25)
  Top 0.25: LED2.2 v55.5,96.75 54.25,98 | D1.3 54.1,98.1 54.25,98 | R2.P2 49.95,98.55 50.5,98 50.55,98 54.25,98
  Top 0.6: C11.P2 C12.P1
  Top 0.75: C12.P1 41.5,106.18 JP111.12
  Bottom 0.5: R220.1 56.5,95.75 v55.5,96.75 54.25,98 46.5,98 45.5,99 45.5,99.75 | Q222.2 46.95,101.2 45.5,99.75 | 45.5,99.75 45.45,99.7 | D211.1 43.35,101.4 43.25,101.5 43.15,101.6 D217.3
  Bottom 0.6: D217.3 43.15,103.6 41.43,105.32 JP111.12 | D211.1 44.95,100.2 45.45,99.7
CELL2  (via drill 0.25)
  Top 0.25: LED3.2 v55.5,92.25 54.25,93.5 | D2.3 54.1,93.65 54.25,93.5 | R5.P2 49.95,93.8 50.25,93.5 54.25,93.5
  Top 0.6: C10.P2 C11.P1
  Top 0.75: C11.P1 38.9,106.24 JP111.11
  Bottom 0.5: D211.3 41.15,97.59 42.24,96.5 45.5,96.5 | Q221.2 45.7,96.7 45.5,96.5 | R219.1 57.25,91.25 56.5,91.25 v55.5,92.25 54.25,93.5 46.5,93.5 45.5,94.5 45.5,96.5
  Bottom 0.6: JP111.11 38.89,105.36 39.25,105 39.85,104.4 D218.1 40.8,103.45 41,103.25 41.5,102.75 41.5,100.75 41.15,100.4 D211.3
CELL3  (via drill 0.25)
  Top 0.25: R12.P2 49.95,89.3 50.25,89 54.1,89 | LED4.2 v55.5,87.75 54.1,89.15 | D4.3 54.1,89.15 | 54.1,89.15 54.1,89 | 54.1,89 54.1,89.15
  Top 0.6: C9.P2 C10.P1
  Top 0.75: C10.P1 36.3,106.2 JP111.10
  Bottom 0.5: 38.05,99.95 38.25,99.75 | 38.25,99.75 39,99 39,98.24 39.1,98.14 45.04,92.2 45.5,92.2 | Q220.2 45.5,92.2 | R218.1 56.5,86.75 v55.5,87.75 54.25,89 46.5,89 45.5,90 45.5,92.2 | D212.1 37.55,100.45 38.25,99.75
  Bottom 0.6: D212.1 36.85,101.1 37.25,101.5 37.65,101.9 D218.3 37.65,103.35 36.35,104.65 JP111.10
CELL4  (via drill 0.25)
  Top 0.25: D5.3 54.1,84.65 | R21.P2 49.95,84.8 50.25,84.5 53.95,84.5 54.1,84.65 | LED5.2 v55.5,83.25 54.1,84.65
  Top 0.6: C8.P2 C9.P1
  Top 0.75: C9.P1 33.8,106.24 JP111.9
  Bottom 0.5: Q219.2 46.3,87.7 45.5,88.5 | 45.5,88.5 37.5,96.5 36.25,96.5 35.75,97 34.65,98.1 D212.3 34.65,100.15 35.25,100.75 35.75,101.25 35.75,101.35 | R217.1 56.5,82.25 v55.5,83.25 54.25,84.5 46.5,84.5 45.5,85.5 45.5,88.5
  Bottom 0.6: JP111.9 33.81,105.19 34,105 34.1,104.9 D219.1 35.05,103.45 35.25,103.25 35.75,102.75 35.75,101.35
CELL5  (via drill 0.25)
  Top 0.25: LED6.2 v55.5,78.75 54.38,79.88 | D7.3 54.1,80.15 54.38,79.88 | R27.P2 49.95,80.3 50.25,80 54.25,80 54.38,79.88
  Top 0.6: JP111.8 31.25,106.23 | C7.P2 C8.P1
  Top 0.75: C8.P1 31.3,106.22 JP111.8
  Bottom 0.5: Q214.2 46.3,83.2 45.5,84 | 45.5,84 44.5,85 44.5,88 37,95.5 35.75,95.5 33.75,97.5 33,98.25 33,99 32.05,99.95 31.55,100.45 D213.1 | R216.1 56.5,77.75 v55.5,78.75 54.25,80 46.5,80 45.5,81 45.5,84
  Bottom 0.6: JP111.8 31.27,105.23 31.5,105 31.9,104.6 D219.3 31.9,101.9 31.5,101.5 31.1,101.1 D213.1
CELL6  (via drill 0.25)
  Top 0.25: LED7.2 v55.5,74.25 54.25,75.5 | D8.3 54.1,75.65 54.25,75.5 | R30.P2 49.95,75.8 50.25,75.5 54.25,75.5
  Top 0.6: C6.P2 C7.P1
  Top 0.75: C7.P1 28.7,106.22 JP111.7
  Bottom 0.5: D213.3 28.9,98.1 29.75,97.25 32.5,97.25 35.25,94.5 36.5,94.5 43.5,87.5 43.5,84.5 44.5,83.5 44.5,80.5 45.5,79.5 | Q212.2 46.3,78.7 45.5,79.5 | R214.1 56.5,73.25 v55.5,74.25 54.25,75.5 46.5,75.5 45.5,76.5 45.5,79.5 | 28.75,105.25 28.73,105.27
  Bottom 0.6: 28.75,105.25 28.1,104.6 D220.1 29.3,103.45 29.75,103 29.75,101 29.5,100.75 28.9,100.15 D213.3 | 28.73,105.27 JP111.7
CELL7  (via drill 0.25)
  Top 0.25: LED8.2 v55.5,69.75 54.25,71 | D10.3 54.1,71.15 54.25,71 | R33.P2 49.95,71.3 50.25,71 54.25,71
  Top 0.6: C5.P2 C6.P1
  Top 0.75: C6.P1 26.2,106.24 JP111.6
  Bottom 0.5: Q211.2 46.3,74.2 45.5,75 | 45.5,75 44.5,76 44.5,79 43.5,80 43.5,83 42.5,84 42.5,87 36,93.5 34.75,93.5 32,96.25 29.25,96.25 27,98.5 27,99.5 26.55,99.95 26.05,100.45 D214.1 | R212.1 56.5,68.75 v55.5,69.75 54.25,71 46.5,71 45.5,72 45.5,75
  Bottom 0.6: JP111.6 26.19,105.44 26,105.25 25.9,105.15 D220.3 25.9,101.9 25.5,101.5 25.1,101.1 D214.1
CELL8  (via drill 0.25)
  Top 0.25: D11.3 54.1,66.65 54.25,66.5 | 54.25,66.5 v55.5,65.25 LED9.2 | R42.P2 49.95,66.8 50.25,66.5 54.25,66.5
  Top 0.6: C4.P2 C5.P1
  Top 0.75: C5.P1 23.6,106.2 JP111.5
  Bottom 0.5: D214.3 22.9,98.1 24,97 27,97 28.75,95.25 31.5,95.25 34.25,92.5 35.5,92.5 37.5,90.5 39.75,88.25 40.25,87.75 40.5,87.5 41.5,86.5 41.5,83.5 42.5,82.5 42.5,80 42.5,79.5 43.5,78.5 43.5,75.5 44.5,74.5 44.5,71.5 45.5,70.5 | Q209.2 46.3,69.7 45.5,70.5 | R209.1 56.5,64.25 v55.5,65.25 54.25,66.5 46.5,66.5 45.5,67.5 45.5,70.5
  Bottom 0.6: D221.1 23.2,103.45 23.65,103.9 23.65,104.75 | 23.65,104.75 JP111.5 | D214.3 22.9,100.15 23.5,100.75 23.65,100.9 23.65,104.75
CELL9  (via drill 0.25)
  Top 0.25: LED10.2 v55.5,60.75 54.38,61.88 | D12.3 54.1,62.15 54.38,61.88 | R49.P2 49.95,62.3 50.25,62 54.25,62 54.38,61.88
  Top 0.6: C3.P2 C4.P1
  Top 0.75: C4.P1 21.1,106.24 JP111.4
  Bottom 0.5: Q205.2 46.3,65.2 45.5,66 | 45.5,66 44.5,67 44.5,70 43.5,71 43.5,74 42.5,75 42.5,78 41.5,79 41.5,82 40.5,83 40.5,86 39.5,87 38,88.5 35,91.5 33.75,91.5 31,94.25 28.25,94.25 26.5,96 23.5,96 21,98.5 21,99.5 20.55,99.95 20.05,100.45 D215.1 | R207.1 56.5,59.75 v55.5,60.75 54.25,62 46.5,62 45.5,63 45.5,66
  Bottom 0.6: JP111.4 21.11,105.36 20.5,104.75 19.9,104.15 D221.3 19.9,101.9 19.5,101.5 19.1,101.1 D215.1
CELL10  (via drill 0.25)
  Top 0.25: LED11.2 v55.5,56.25 54.25,57.5 | D14.3 54.1,57.65 54.25,57.5 | R57.P2 49.95,57.8 50.25,57.5 54.25,57.5
  Top 0.6: C2.P2 C3.P1
  Top 0.75: C3.P1 18.6,106.22 JP111.3
  Bottom 0.5: D215.3 16.9,98.1 18.5,96.5 21.5,96.5 23,95 26,95 27.75,93.25 30.5,93.25 33.25,90.5 34.6,90.5 39.5,85.6 39.5,82.5 40.5,81.5 40.5,78.5 41.5,77.5 41.5,74.5 42.5,73.5 42.5,70.5 43.5,69.5 43.5,66.5 44.5,65.5 44.5,62.5 | Q204.2 46.3,60.7 45.5,61.5 | 45.5,61.5 44.5,62.5 | R205.1 56.5,55.25 v55.5,56.25 54.25,57.5 46.5,57.5 45.5,58.5 45.5,61.5 | 45.5,61.5 44.5,62.5
  Bottom 0.6: D222.1 17.45,103.45 17.5,103.4 | D215.3 16.9,100.15 17.5,100.75 17.5,102.5 17.5,103.4 | JP111.3 18.57,104.47 17.5,103.4
CELL11  (via drill 0.25)
  Top 0.25: LED12.2 v55.5,51.75 54.25,53 | D16.3 54.1,53.15 54.25,53 | R65.P2 49.95,53.3 50.25,53 54.25,53
  Top 0.6: C1.P2 C2.P1
  Top 0.75: C2.P1 16,106.22 JP111.2
  Bottom 0.5: Q201.2 46.3,56.2 45.5,57 | 45.5,57 45.88,56.62 | 45.88,56.62 45.5,57 | 45.5,57 44.5,58 44.5,61 43.5,62 43.5,65 42.5,66 42.5,69 41.5,70 41.5,73 40.5,74 40.5,77 39.5,78 39.5,81 38.5,82 38.5,85.25 34.25,89.5 32.75,89.5 30,92.25 27.25,92.25 25.5,94 22.5,94 21,95.5 18,95.5 15,98.5 15,99.5 14.55,99.95 14.05,100.45 D216.1 | R204.1 56.5,50.75 v55.5,51.75 54.25,53 46.5,53 45.5,54 45.5,57 | 45.5,57 45.88,56.62
  Bottom 0.6: D216.1 13.35,101.1 13.75,101.5 13.9,101.65 D222.3 13.9,103.4 16.03,105.53 JP111.2
CELL12  (via drill 0.25)
  Top 0.25: D19.3 54.1,49.35 53.5,48.75 50.5,48.75 | 49.75,48.75 50,48.75 | 50,48.75 50.5,48.75 | 49.75,48.75 49.5,48.75 49.25,48.5 v48.5,48.5 48,48.5 47.7,48.2 L1.P1 | 49.75,48.75 50,48.75 | 50,48.75 50.5,48.75 | R76.P2 49.95,48.8 50,48.75
  Top 0.75: C1.P1 13.5,106.24 JP111.1
  Bottom 0.25: 46.3,51.7 46.3,51.05 45.75,50.5 45.75,49 46.25,48.5 v48.5,48.5
  Bottom 0.5: D216.3 11.15,97.85 12.5,96.5 15.5,96.5 17.5,94.5 20.5,94.5 22,93 25,93 26.75,91.25 29.5,91.25 32.25,88.5 33.75,88.5 37.5,84.75 37.5,81.5 38.5,80.5 38.5,77.5 39.5,76.5 39.5,73.5 40.5,72.5 40.5,69.5 41.5,68.5 41.5,65.5 42.5,64.5 42.5,61.5 43.5,60.5 43.5,57.5 44.5,56.5 44.5,53.5 46.3,51.7 Q200.2
  Bottom 0.6: D216.3 11.15,103.91 13.49,106.25 JP111.1
CHARGER  (via drill 0.25)
  Top 0.25: U5.2 16.43,52.08 v16,52.5 | R35.P2 14.7,71.7 13,70 8,70 7.5,69.5 7.5,67.75 3.75,64 JP8.P1 7,61 7.8,60.2 C43.1 9.5,59.25 10.5,58.25 D18.C 12.36,57.11 12.75,57.5 16,57.5 16.5,58 16.5,60.75 16.8,61.05 R51.P2 16.8,63.7 15.75,64.75 U4.P6
  Top 1: 6.25,63.5 JP8.P1 6.25,58.5
  Bottom 0.25: JP8.P1 3.75,58 5,56.75 5,56 7.5,53.5 15,53.5 v16,52.5
  Bottom 1: 4,60.75 JP8.P1 | JP8.P1 6.25,63.5 | JP8.P1 6,58.75 | 9.5,58.5 9.5,57 7.25,54.75 | 9.75,58.5 9.75,60 6.75,63
  pour Bottom (isolate 0.5, rank 4): 3.5,64.5 5.25,64.5 7.25,63.5 9.75,63.5 9.75,53.75 7.5,53.75 3.5,57.5
  pour Top (isolate 0.5, rank 2): 3.5,64.5 3.5,57.5 4.5,56.5 10.75,56.5 10.75,60 9.25,61.5 8.75,61.5 5.75,64.5
CHARGER_SENSE  (via drill 0.25)
  Top 0.25: U5.3 17.07,52.08 v17.5,52.5 | U4.P5 15.25,64.6 16,63.85 16,58.75 v15.75,58.5
  Bottom 0.22: Q203.8D 17.59,56.59 arc-45 17.67,56.77 19.5,58.6 | Q203.6D 20.14,58.01 arc45 20.06,58.19 19.75,58.5
  Bottom 0.25: Q202.6D 25.89,57.91 | 25.89,57.91 Q202.9D | Q202.5D 27.16,56.65 25.89,57.91 | 20.39,57.87 19.75,58.5 19.75,58.25 | Q203.8D 17.46,56.46 16.5,55.5 15.75,56.25 12.5,56.25 14.75,58.5 v15.75,58.5 | v17.5,52.5 17.5,53.5 | 22.5,58 22.5,55.75
  Bottom 0.3: Q203.5D Q202.8D
  Bottom 0.5: 16.75,54.5 16.75,55.25 16.5,55.5
  Bottom 1: 16.75,54.5 13.75,57.75 R206.P2 13.75,60 15.5,61.75
  pour Bottom (isolate 0.4, rank 5): 13.5,62.75 16.5,62.75 16.5,59.25 28.75,59.25 28.75,53.25 13.5,53.25
CHRG_AOUT
  Top 0.25: U4.P11 13.75,69.25 14.25,69.75 16.5,69.75 17.5,68.75 R40.P2 18.55,68.2 19,67.75 19.75,67.75 20.2,67.3 R44.P2
CHRG_CURRENT  (via drill 0.25)
  Top 0.2: U6.19 27.25,35.8 27.45,36 v27.45,36.4 | R70.P2 21.2,52.55 21.2,52.05 v21.25,52
  Top 0.25: R70.P2 C44.P1 21.25,55.05 TP7.P1 21.2,56.3 R60.P2
  Bottom 0.2: v21.25,52 21,51.75 21,43.3 23.25,41.05 23.25,38.1 23.68,37.67 | v27.45,36.4 25.7,36.4 24.95,36.4 23.68,37.67 | 23.35,38 23.68,37.67
CHRG_EN
  Top 0.25: TP5.P1 U4.P9
CHRG_FB
  Top 0.2: U4.P2 13.75,64.35 13.6,64.2 13.6,63.75 | 13.6,63.75 13.6,63.45 | 13.6,63.45 13.6,63.75 | R56.P1 13.05,59.3 13.35,59.6 13.4,59.65 13.65,59.65 13.95,59.95 R53.P2 13.95,61.2 14,61.25 14.25,61.5 14.25,62.8 13.6,63.45 | 13.6,63.75 13.6,63.45
CHRG_FLT  (via drill 0.25)
  Top 0.18: 19.25,67.25 19.5,67 19.5,63.75 20,63.25 | 23.5,22.5 20,22.5
  Top 0.2: R113.P2 24.2,21.8 23.5,22.5 | 20,22.5 17.5,20 v14.75,20
  Top 0.22: 21,62.75 21,61.16 arc66 21.15,60.93 21.92,60.48 arc-39 22.04,60.37 22.69,58.36 22.75,58.15
  Top 0.25: U4.P8 15.25,68.5 15.5,68.75 16.5,68.75 18,67.25 19.25,67.25 | 20,63.25 20.5,63.25 21,62.75 | 22.75,58.15 v22.75,52.5
  Bottom 0.2: v22.75,52.5 22,52.5 21.75,52.75 21,52.75 20.5,52.25
  Bottom 0.25: 20.5,52.25 20.5,36.5 14,30 14,29 14.75,28.25 v14.75,20
CHRG_SENSE  (via drill 0.25)  (2 unrouted)
  Top 0.25: R99.P1 C51.P1 | U4.P12 13.25,69.5 14.05,70.3 R35.P1 R36.P2 20.3,70.25 21,70.25 21.25,70.5 21.25,72.25 21.75,72.75 24.25,72.75 26,74.5 v26,76.5
  Bottom 0.25: 36.25,44.75 36.25,47.5 37.25,48.5 37.25,67.25 35.25,69.25 29.75,69.25 27.25,71.75 27.25,75.25 v26,76.5
CHRG_SHDN  (via drill 0.25)
  Top 0.25: R73.P1 v31,51.75 | U4.P7 16.32,67.92 18,66.25 R44.P1 R47.P2 18.8,63.9 18.2,63.3 R51.P1 18.2,61.2 17.5,60.5 R55.P2 18.3,59.95 19.65,58.6 21.75,58.6 22.25,58.1 22.25,53.25 22,53 22,52 v22.5,51.5
  Bottom 0.25: v31,51.75 28,51.75 27,52.75 25.75,52.75 24.5,51.5 v22.5,51.5
CSBO
  Top 0.25: U3.1 36.38,61.38 36.75,61 37.75,61 39.25,59.5 39.25,54 JP10.P2
FAULT  (via drill 0.25)
  Top 0.2: U6.40 26.25,25.7 25,24.45 R113.P1 | R112.P1 R113.P1 | R114.P1 26.5,21.75 25.75,22.5 25.05,23.2 R113.P1
  Top 0.25: R112.P1 v22.5,24.25 | R105.P1 16.2,29.55 v16.25,29.5
  Bottom 0.25: v16.25,29.5 16.25,28.75 16.25,25.75 18.5,23.5 21.75,23.5 v22.5,24.25
GND  (via drill 0.25)  (2 unrouted)
  Top 0.2: U4.TAB 14.25,66.25 | v30.25,83.75 30,84 | 30,84.25 30,84 | 29.98,83.97 30,84
  Top 0.25: U9.8 23.25,1.5 23.5,1.75 U9.17 | U3.30 U3.31 | U1.P10 37.5,89.5 | 37.5,89.5 U1.TAB | U2.5 29.98,83.97 | 40.5,91.2 R16.P1 40.45,90.5 39.75,90.5 38.75,89.5 37.5,89.5 | 40.5,91.2 40.5,91.75 | C13.P2 40.55,95.25 41.5,95.25 42,94.75 v42,93.84 42,93.36 41.28,92.64 41.28,91.98 40.5,91.2 | U3.30 30.75,68.75 v31,68.5 | U3.30 27.25,68.75 25.7,70.3 R38.P1 | U4.P10 14.25,66.25 14.25,66 | U5.5 18.7,55.05 19,54.75 | U6.23 25.25,36 24.25,37 24.25,38.75 | 21.75,65.75 23.25,64.25 C38.P2 | 23.45,77 21.75,77 21.5,76.75 21.5,73.5 20.25,72.25 R36.P1 | R53.P1 12.55,61.2 12.05,61.7 C40.P2 | C23.P2 8.75,80.5 7.75,81.5 | R47.P1 20.75,64.5 21.2,64.95 R48.P1 | v39.62,96.1 39.62,95.38 39.5,95.25 40.5,95.25
  Top 1: JP6.P1 6.5,76.75 | JP6.P1 1.5,77.25 | JP6.P1 6,81.75 | 3.75,79.25 1.25,81.75 | JP11.P1 6.25,49.5 | JP11.P1 6.25,54.5 | JP11.P1 1.25,49.5 | JP11.P1 1.25,54.5
  Bottom 0.25: R208.P1 R210.P1 R211.P1 | D210.1 30.55,84.05 v30.25,83.75 | D21.1 38.8,45.55 | D209.1 26.95,46.8 26.5,47.25 v22.75,47.25 | R211.P1 | R213.P1 34.65,71.7 v34.35,72 | R211.P1 30.95,68.45 v31,68.5
  Bottom 0.5: D208.1 52.05,47.95 52.5,47.5 52.5,44.75
  other vias: 26.75,8 25.5,10.25 24.5,9.75 24.5,11 25.5,12.75 23.5,3.25 38.5,1 41.25,1 22.75,49.75 18.6,25.65 24.75,28.5 34.5,44.25 40,40.5 40,36.5 42.5,33.25 37.6,30.05 9,20 41.75,10.5 41.25,12.25 49.5,8.75 25.25,91.5 24.75,91 24.25,91.5 45,40.25 45,42.5 18.75,52 22.4,66.5 20.5,16.25 27,78 32.25,45.75 6.55,65.35 22.25,36.75 23.75,91 40.25,27.5 50.75,1.5 34.5,36.75 31.2,20.4 22.45,27 29.75,31.5 1.5,83.3 33.35,66.25 35.35,60.75 59.1,38 59.1,45.25 49.6,35.5 43.6,26.25 35.6,8.75 37.1,13.75 35.6,11.5 26.85,11.5 39.85,1 16.85,1.75 16.35,7.5 15.1,7.5 13.35,6.75 21.85,41 34.35,58.5 33,86.84 27.75,78.5 23.5,2.25 23.5,4.25
  pour Top (isolate 0.25, rank 6): 0.5,0.5 59.5,0.5 59.5,109.5 0.5,109.5
  pour Bottom (isolate 0.25, rank 6): 0.5,0.5 59.5,0.5 59.5,109.5 0.5,109.5
  pour Route2 (isolate 0.3, rank 6): 1,1 59.5,1 59.5,109.5 1,109.5
GNDIO  (via drill 0.25)
  Top 0.25: 9.45,8.05 D25.1
  Top 0.4: D25.1 9.55,7.2 10,6.75 12.25,6.75 13.55,8.05 U7.P16 14.8,8.55 16.5,10.25 16.5,15.75 14.8,17.45 U7.P9 v11.5,17.45 9.14,17.45 R118.P2 7.7,17.3 7.5,17.5 6.37,18.63 3.52,18.63 JP16.4 | C71.P2 9.45,8.05
  Bottom 0.25: 11.65,17.3 v11.5,17.45
  Bottom 0.4: D203.3 11.65,17.3
GPIO1
  Top 0.25: U3.38 31.75,64.75 33.25,63.25 33.25,57.5 | JP9.P1 33,57.75 33.25,57.5 | R69.P2 R63.P1 33.45,57.3 33.25,57.5
GPIO2
  Top 0.25: U3.39 31.5,64.25 32.75,63 32.75,60 31.25,58.5 30.61,57.87 JP9.P2 29.25,57.75 28.55,57.05 R62.P2 R68.P1
JTDI
  Top 0.2: U6.38 25.25,25.5 24.75,25 22.5,25 22,25 21.75,24.75 20.75,23.75 R111.P1 18.2,23.2 17.98,22.98 | 17.98,22.98 18,23 17.98,22.98 | JTAG.P8 17.98,22.98
JTDO  (via drill 0.25)  (1 unrouted)
  Top 0.2: U6.39 25.75,27 25.5,27.25 24.5,27.25 23.25,26 v21.25,26
  Top 0.25: R55.P1 17.5,58.25 16.25,57 15.25,57 13.75,55.5 13.75,53.25 14.75,52.25 14.75,50.5 | v13.5,28.25 13.5,28 13.5,24.75 14,24.25 JTAG.P6 v19.5,24.25
  Bottom 0.2: v21.25,26 v19.5,24.25
  Bottom 0.25: v13.5,28.25 13.5,46.25 v16.25,49
LED_B
  Top 0.2: U6.29 22.25,31.5 22,31.75 22,35.25 20.5,36.75 R101.P2
LED_G
  Top 0.2: U6.30 21.75,31 21.5,31.25 21.5,33.75 20.5,34.75 R103.P2
LED_R
  Top 0.2: U6.31 21.5,30.5 21,31 21,32.25 20.5,32.75 R104.P2
LOAD  (via drill 0.25)  (3 unrouted)
  Top 0.18: 36,94.5 31.25,94.5
  Top 0.2: U1.P3 37.5,92.5 37,93 36.25,93 36,93.25 36,94.5 36,95 36.2,95.2 R9.P2 | 31.25,94.5 29.25,92.5 23.75,92.5 21.5,90.25 14.5,90.25 14,89.75 14,80 13,79 v7.75,79
  Top 0.25: C25.1 C24.1 12.7,74.45 10.75,72.5 D9.C 7.89,71.39 7,70.5 JP7.P1
  Route15 0.4: v16.35,41.05 16.3,41.05 16.25,41.1
  Route15 1.25: 15,42.5 15,41 16.25,41 16.25,41.1 16.25,42.5 15,42.5
  Route15 1.5: v15.55,42.55 14.45,42.55
  Route15 2: 14.45,42.55 9,48 9,67 5.5,70.5 JP7.P1
  Bottom 0.25: Q206.1S 7.91,64.84 7.5,65.25 7.5,66.25 | 7.5,66.25 7.5,67.5 | 7.5,67.5 7.5,70 7,70.5 | Q206.2S 7.63,66.11 7.5,66.25 | Q206.3S 7.62,67.39 7.5,67.5 | Q210.1S 7.91,70.34 7.75,70.5 7.25,70.5 | 7.25,70.5 7,70.5 | Q210.2S 8.12,71.61 7,70.5 | 7,70.5 JP7.P1 | Q210.3S 7.88,72.89 7.75,72.75 | 7.75,72.75 7.75,71 7.25,70.5 | Q213.1S 8.35,75.84 7.75,75.25 | 7.75,75.25 7.75,72.75 | Q213.2S 8.12,77.11 7.75,76.75 | 7.75,76.75 7.75,75.25 | Q213.3S 8.13,78.39 7.75,78 | 7.75,78 7.75,76.75 | v7.75,79 7.75,78 | v15.55,42.55 v15.55,41.8 v15.55,41.05 | v16.35,41.8 v16.35,42.55 | v16.35,41.05 v16.35,41.8 | D207.3 18.4,41.8 v16.35,41.8
  Bottom 2: 6.25,73 JP7.P1 6.5,67.75
  pour Bottom (isolate 0.4, rank 4): 3.5,75.5 7.5,79.5 10,79.5 10,64.75 7.75,64.75 3.5,67.5
  pour Top (isolate 0.5, rank 3): 3.25,70.25 3.44,73.56 4.44,74.5 19.5,74.5 19.5,73 11.75,73 9,70.25
  pour Top (isolate 0.5, rank 2): 13.2,42.1 14.6,42.1 15.5,43 18.2,43 18.2,41.85 15.35,39 13.2,39
  pour Bottom: 15.25,43 16.5,43 17.25,42.25 18.75,42.25 18.75,40.75 15.25,40.75
LOAD_AOUT
  Top 0.18: 35.25,83 35.25,82.5 35.75,82 36.75,82 37.5,82.75 39.61,82.75
  Top 0.25: U1.P11 38,87 37.75,86.75 | 37.75,86.75 37.6,86.6 | 35.25,83 37.1,84.85 R23.P2 37.1,86.1 37.75,86.75 | 39.61,82.75 40.25,83.39 40.25,85.75 41.25,86.75 41.25,88.25 42.25,89.25 42.25,92.5 42.25,92.75 42.98,93.48 42.98,93.49 42.98,95.02 41.15,96.85 36.75,96.85 35.5,95.6 R8.P2
LOAD_EN
  Top 0.25: U1.P9 TP3.P1
LOAD_FB
  Top 0.25: R9.P1 R10.P2 38.75,92.75 TP1.P1 38.25,92 38,91.75 U1.P2
LOAD_FLT  (via drill 0.25)
  Top 0.18: 34,22.75 33.75,22.5 29,22.5 28.7,22.5 R114.P2